# Altium schematic sheet _humidity.SchDoc
size Tabloid
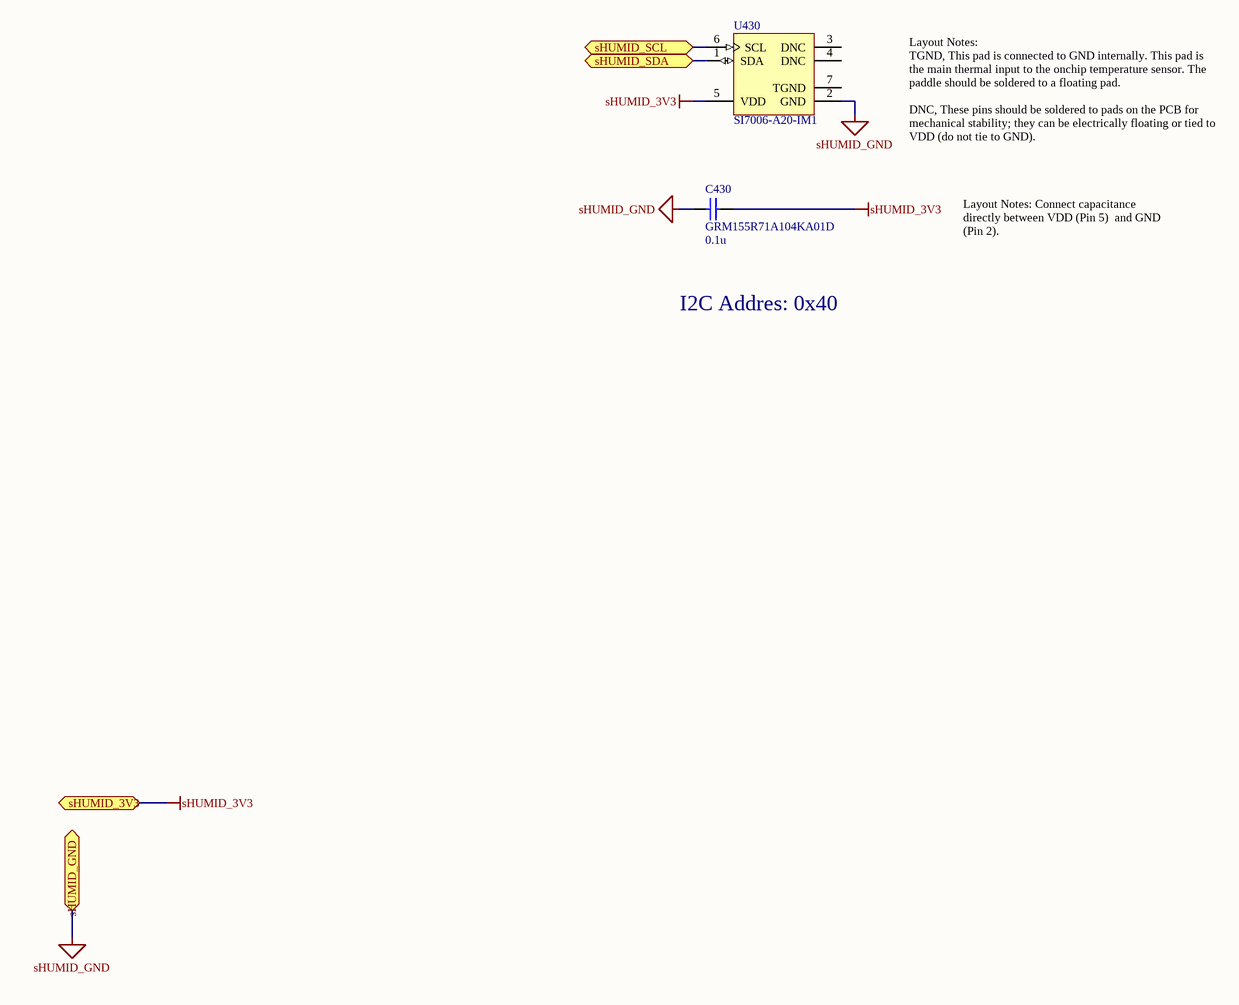
[diagram p0: _humidity.SchDoc]

## Parts
C430  GRM155R71A104KA01D  value 0.1u  [0402]
U430  SI7006-A20-IM1  [SLAB-DFN-6-1500X2400TP_V]

## Ports
sHUMID_3V3, sHUMID_GND, sHUMID_SCL, sHUMID_SDA

## Nets
sHUMID_3V3: C430.2 U430.5(VDD) ; port sHUMID_3V3
sHUMID_GND: C430.1 U430.2(GND) ; port sHUMID_GND
sHUMID_SCL: U430.6(SCL) ; port sHUMID_SCL
sHUMID_SDA: U430.1(SDA) ; port sHUMID_SDA

Not connected (* = marked no-connect by the designer): U430 3(DNC) 4(DNC) 7(TGND)

## Notes on the sheet
- Layout Notes:
  TGND, This pad is connected to GND internally. This pad is the main thermal input to the onchip temperature sensor. The paddle should be soldered to a floating pad.
  DNC, These pins should be soldered to pads on the PCB for mechanical stability; they can be electrically floating or tied to VDD (do not tie to GND).
- Layout Notes: Connect capacitance directly between VDD (Pin 5)  and GND (Pin 2).
- I2C Addres: 0x40

## Library data of the parts
C430 = GRM155R71AxxxKdddd: -55-125C, 1005, 10V, X7R, ±10%
U430 = CMP-2000-07060-1: I2C Humidity and Temperature Sensor, 1.9 to 3.6 V, -40 to 125 degC, 6-Pin DFN, RoHS, Tube; Manufacturer: Silicon Labs; Output Type: Digital; Resolution: 12(Humidity)bit,14(Temperature)bit; Minimum Operating Supply Voltage: 1.9V; Sensor Function: Temperature&Humidity; Accuracy: ±1°C,±5%RH; Maximum Operating Supply Voltage: 3.6V; Pin Count: 6; Maximum Operating Temperature: +125°C; Package Reference: DFN-6; Height: 0.75mm; Datasheet URL: https://www.silabs.com/Support%20Documents%2FTechnicalDocs%2FSi7006-A20.pdf; Datasheet Version: Rev. 1.1, 06/2015; Package Type: DFN; Mounting Technology: SurfaceMount; Dimensions: 3x3x0.75mm; Length: 3mm; Package Description: 6-Pin Small Outline No-Lead Package, Body 3 x 3 mm, Pitch 1 mm; Minimum Operating Temperature: -40°C; Interface Type: I2C; Mounting Type: SurfaceMount; Width: 3mm; Manufacturer URL: http://www.silabs.com/